# EAGLE schematic connector_v1 (EAGLE 7.3.0)
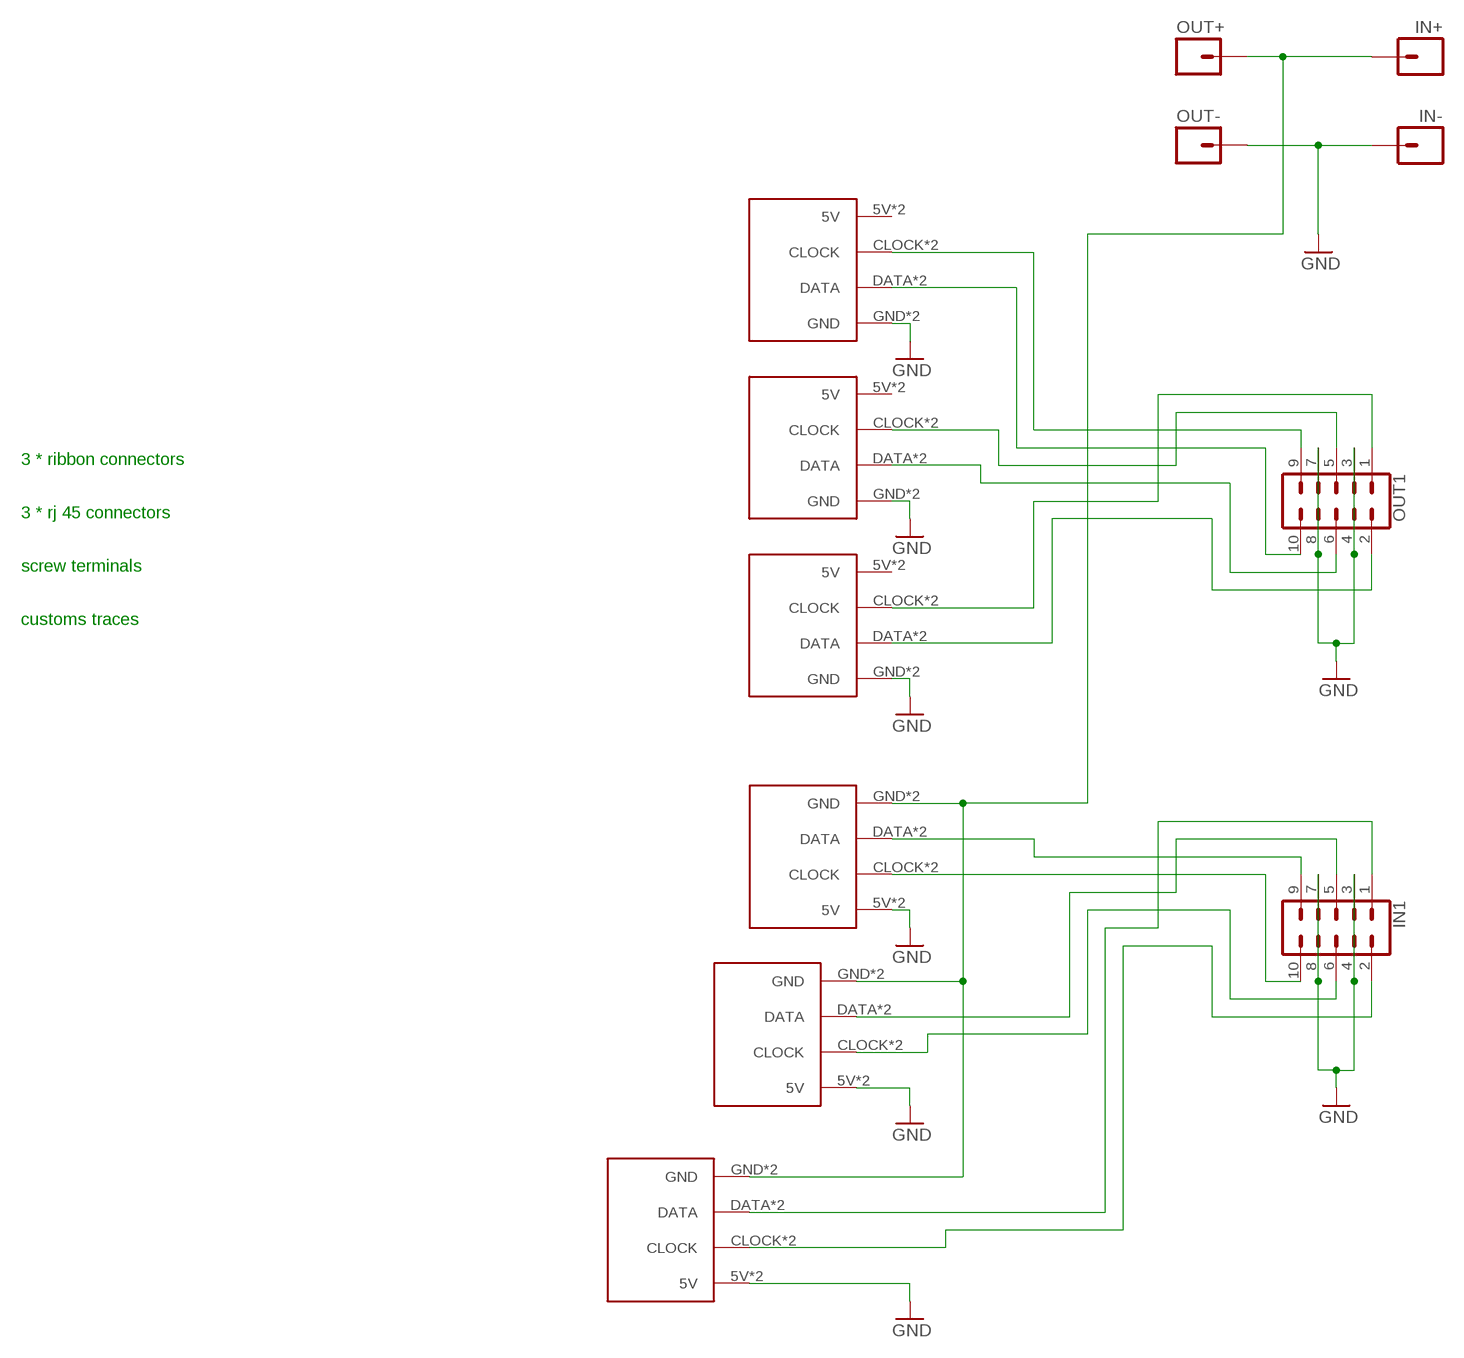
[diagram p0: schematic, sheet 1]

## Parts
IN1  CONN_05X2SHD_LOCK  [2X5-SHROUDED_LOCK]
IN+  M01PTH_2MM  [1X01_2MM]
IN-  M01PTH_2MM  [1X01_2MM]
INSTRIP1  APA102STRIP  [APA102STRIP]
INSTRIP2  APA102STRIP  [APA102STRIP]
INSTRIP3  APA102STRIP  [APA102STRIP]
OUT1  CONN_05X2SHD_LOCK  [2X5-SHROUDED_LOCK]
OUT+  M01PTH_2MM  [1X01_2MM]
OUT-  M01PTH_2MM  [1X01_2MM]
OUTSTRIP1  APA102STRIP  [APA102STRIP]
OUTSTRIP2  APA102STRIP  [APA102STRIP]
OUTSTRIP3  APA102STRIP  [APA102STRIP]

## Nets
GND: IN1.3 IN1.4 IN1.7 IN1.8 IN-.1 INSTRIP1.5V INSTRIP1.5V2(5V) INSTRIP2.5V INSTRIP2.5V2(5V) INSTRIP3.5V INSTRIP3.5V2(5V) OUT1.3 OUT1.4 OUT1.7 OUT1.8 OUT-.1 OUTSTRIP1.GND OUTSTRIP1.GND2(GND) OUTSTRIP2.GND OUTSTRIP2.GND2(GND) OUTSTRIP3.GND OUTSTRIP3.GND2(GND)
N$1: IN1.9 INSTRIP3.DATA INSTRIP3.DATA2(DATA)
N$2: IN1.10 INSTRIP3.CLOCK INSTRIP3.CLOCK2(CLOCK)
N$3: IN1.5 INSTRIP2.DATA INSTRIP2.DATA2(DATA)
N$4: IN1.6 INSTRIP2.CLOCK INSTRIP2.CLOCK2(CLOCK)
N$5: IN1.1 INSTRIP1.DATA INSTRIP1.DATA2(DATA)
N$6: IN1.2 INSTRIP1.CLOCK INSTRIP1.CLOCK2(CLOCK)
N$8: IN+.1 INSTRIP1.GND INSTRIP1.GND2(GND) INSTRIP2.GND INSTRIP2.GND2(GND) INSTRIP3.GND INSTRIP3.GND2(GND) OUT+.1
N$9: OUT1.9 OUTSTRIP3.CLOCK OUTSTRIP3.CLOCK2(CLOCK)
N$10: OUT1.10 OUTSTRIP3.DATA OUTSTRIP3.DATA2(DATA)
N$11: OUT1.5 OUTSTRIP2.CLOCK OUTSTRIP2.CLOCK2(CLOCK)
N$12: OUT1.6 OUTSTRIP2.DATA OUTSTRIP2.DATA2(DATA)
N$13: OUT1.1 OUTSTRIP1.CLOCK OUTSTRIP1.CLOCK2(CLOCK)
N$14: OUT1.2 OUTSTRIP1.DATA OUTSTRIP1.DATA2(DATA)
Unconnected: OUTSTRIP1.5V OUTSTRIP1.5V2(5V) OUTSTRIP2.5V OUTSTRIP2.5V2(5V) OUTSTRIP3.5V OUTSTRIP3.5V2(5V)

## Notes on the sheet
- 3 * ribbon connectors
- 3 * rj 45 connectors
- screw terminals
- customs traces

## Library data of the parts
IN1 OUT1 = SparkFun-Connectors:CONN_05X2: Multi connection point. Often used as Generic Header-pin footprint for 0.1 inch spaced/style header connections For AVR SPI programming port, see special device with nice symbol: "AVR_SPI_PROG_5x2.dev" You can populate with any combo of single row headers, but if you'd like an exact match, check these: 2x5 AVR ICSP Male Header <https://www.sparkfun.com/products/778> (PRT-00778) 2x5 Pin Shrouded Header <https://www.sparkfun.com/products/8506> (PRT-08506) On any of the 0.1 inch spaced packages, you can populate with these: Break Away Headers - Straight <https://www.sparkfun.com/products/116> (PRT-00116) Break Away Male Headers - Right Angle <https://www.sparkfun.com/products/553> (PRT-00553) Female Headers <https://www.sparkfun.com/products/115> (PRT-00115) Break Away Headers - Machine Pin <https://www.sparkfun.com/products/117> (PRT-00117) Break Away Female Headers - Swiss Machine Pin <https://www.sparkfun.com/products/743> (PRT-00743) Special note: the shrouded connector mates well with our 5x2 ribbon cables: 2x5 Pin IDC Ribbon Cable <https://www.sparkfun.com/products/8535> (PRT-08535); PROD_ID: CONN-08671; SF_ID: PRT-08506
IN+ IN- OUT+ OUT- = SparkFun-Connectors:M01: Header 1 Standard 1-pin 0.1" header. Use with straight break away headers (SKU : PRT-00116), right angle break away headers (PRT-00553), swiss pins (PRT-00743), machine pins (PRT-00117), and female headers (PRT-00115). SMTSO-256-ET is a "flush mount" nut for a 4-40 screw. The older package used to be too tight, and did not allow it to sit properly thru the drill hit. The latest (0.165DIA) fits nice and snug.
INSTRIP1-INSTRIP3 OUTSTRIP1-OUTSTRIP3 = LucasParis:APA102STRIP